# EAGLE design Antenna (EAGLE 7.6.0)

## Sheet 1 of 2

## Sheet 2 of 2
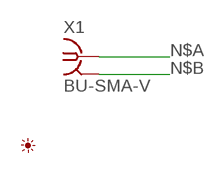
[diagram p0: schematic, sheet 2]

### Parts
PICTO1  PICTO_1  [PICTO_1]
X1  BU-SMA-V  [BU-SMA-V]

### Nets
N$A: X1.1
N$B: X1.2 X1.3 X1.4 X1.5

## Library data of the parts
PICTO1 = My_Picto:PICTO_1: Zdenek Brichacek; OK3ZB; http://blog.brichacek.net
X1 = con-coax:BU-SMA-V: FEMALE SMA CONNECTOR Radiall distributor RS 112-3794; OC_FARNELL: unknown; OC_NEWARK: unknown

## Net classes
1 RF: width 2.5 mm, clearance 0.508 mm
2 net: width 0.6 mm, clearance 0.254 mm

## Board
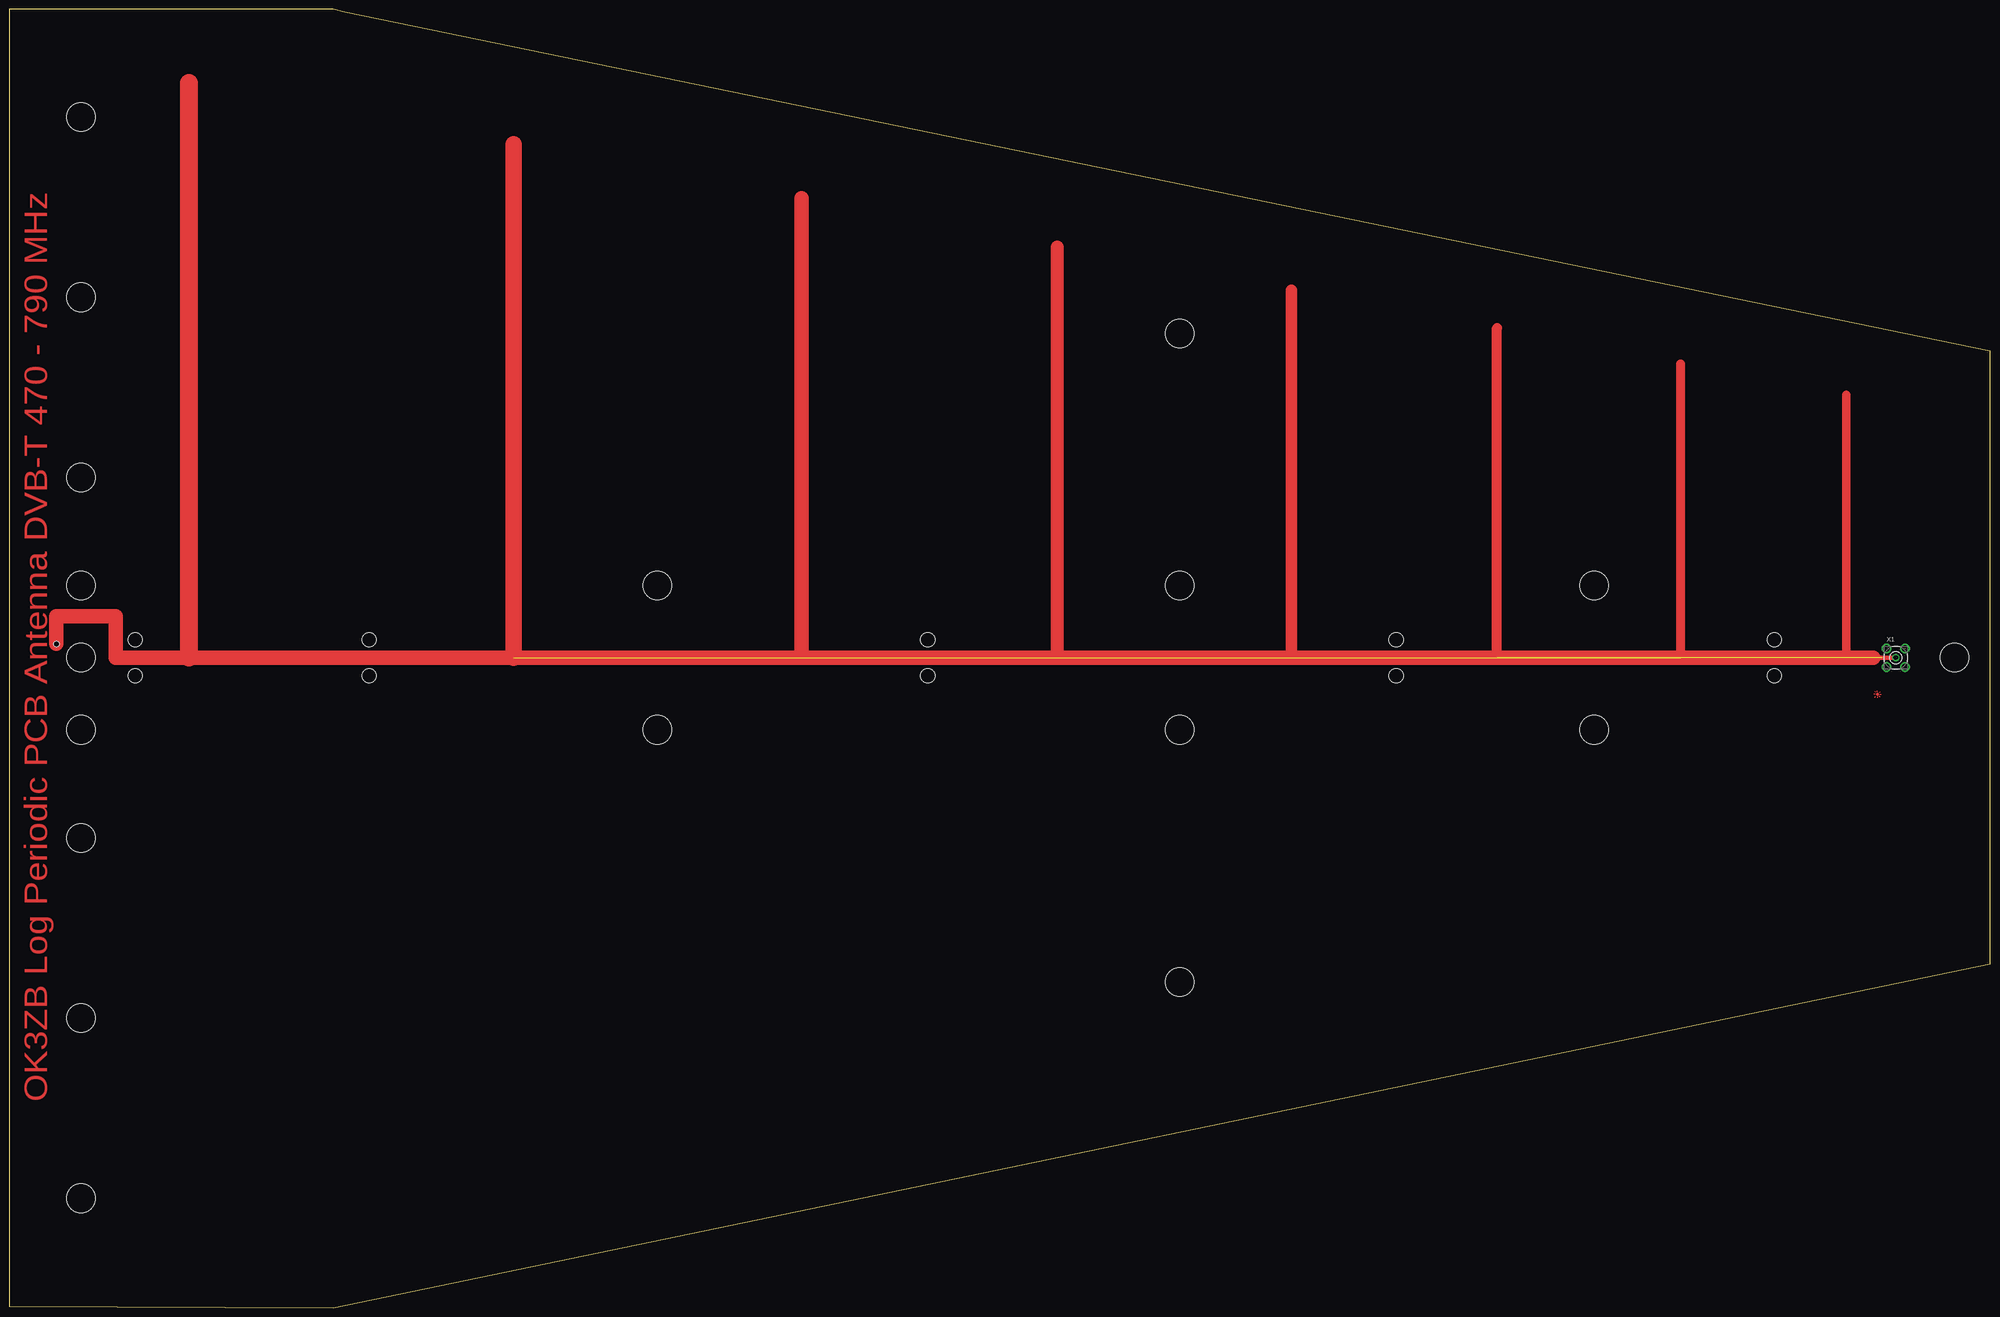
[diagram p1: board, top side]
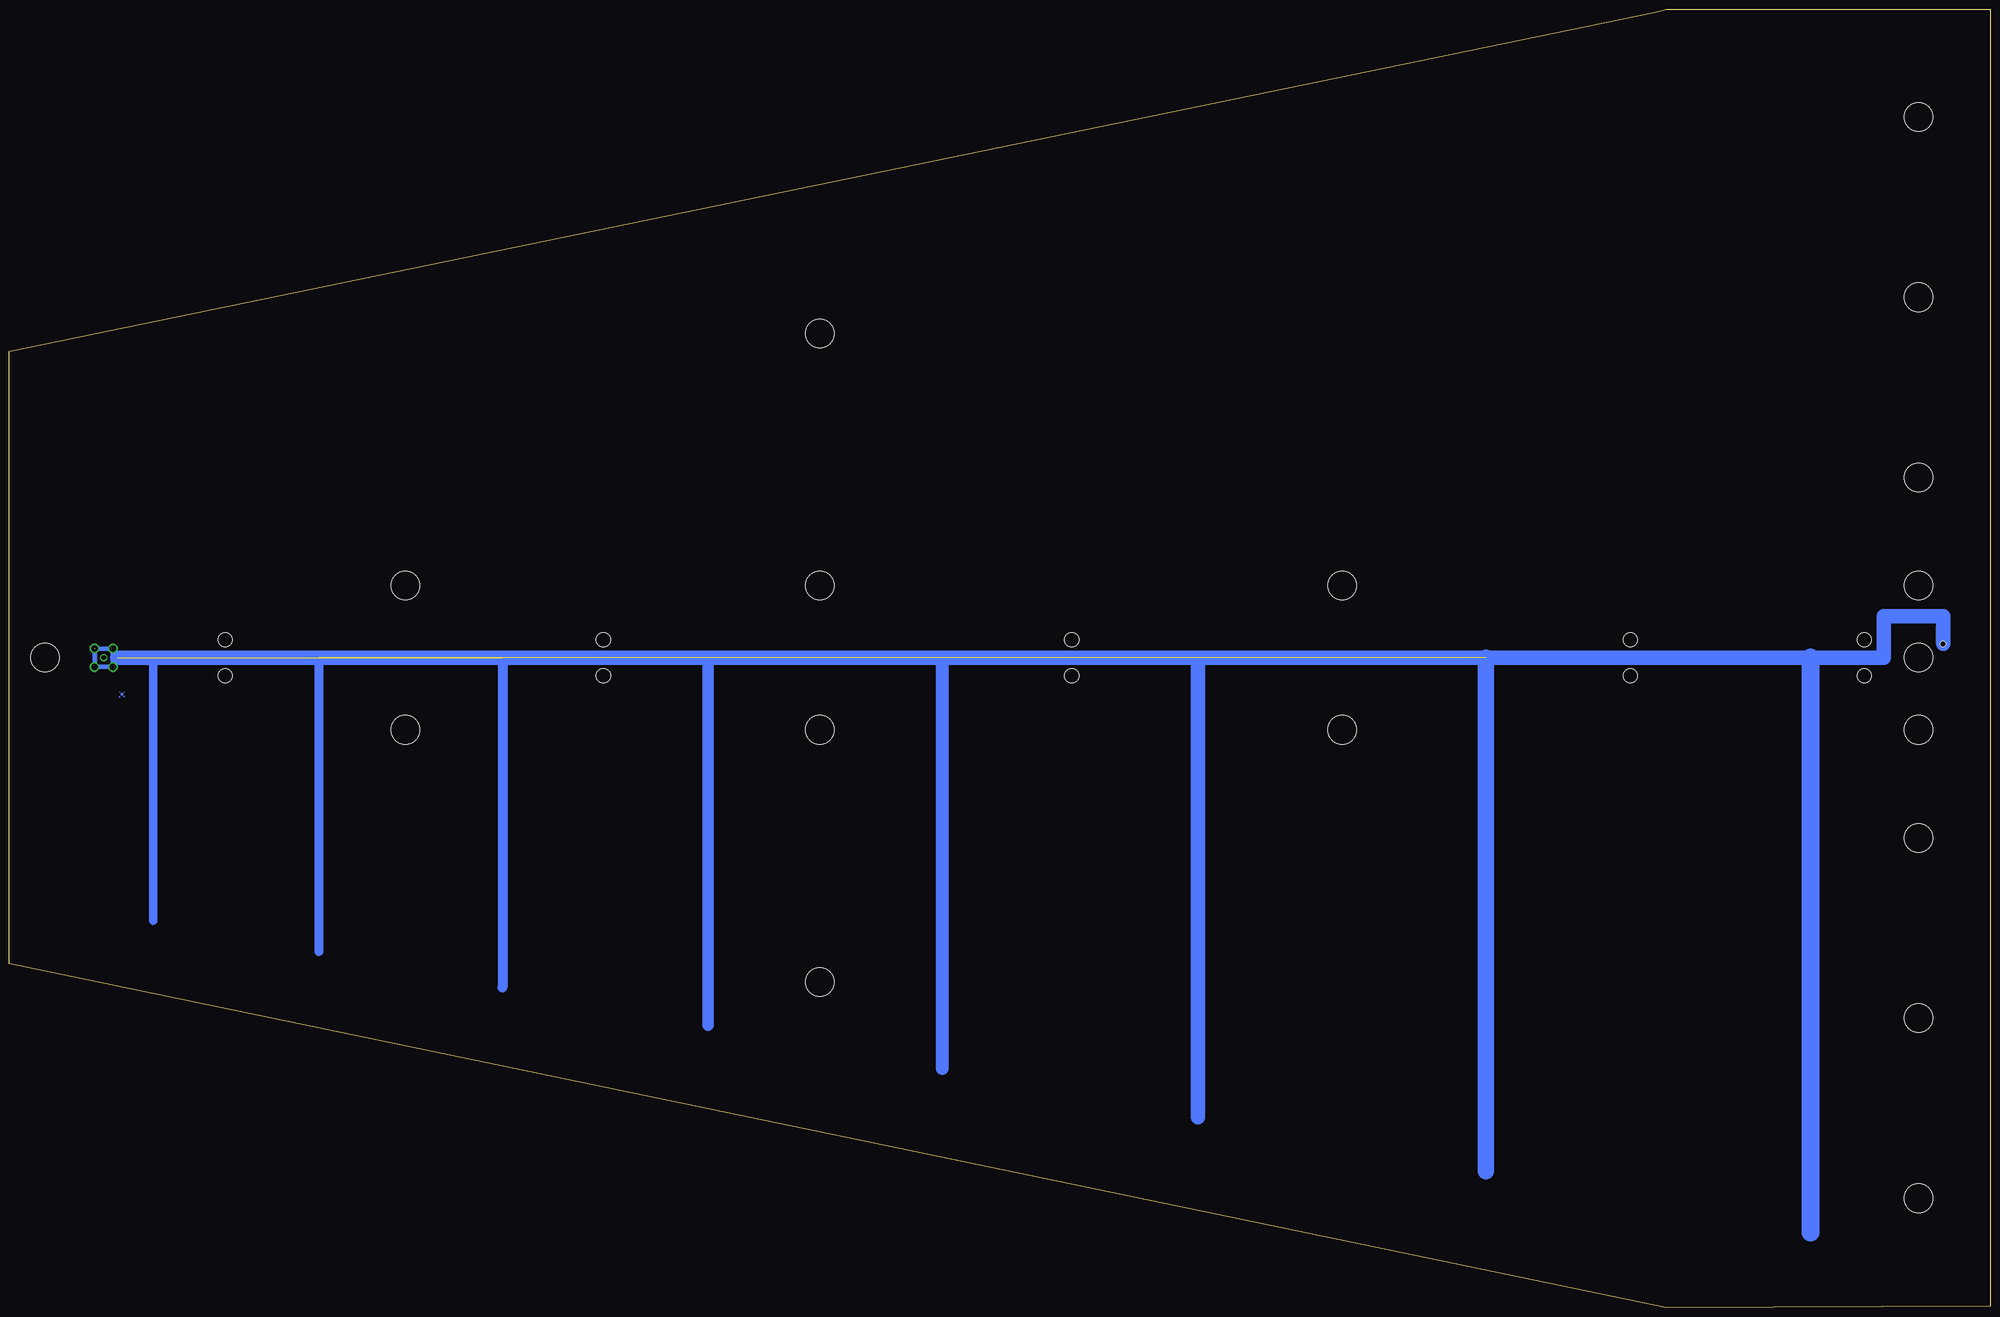
[diagram p2: board, bottom side, seen from below]

Size 550 x 360.34 mm. Coordinates in mm from the lower left corner, seen from the top.
Outline: 0,0.34 90,0 550,95.34 550,265.34 93.18,359.41 90,360.34 0,360.34 0,0.34
Copper layers (1*16): Top 0.035mm / dielectric 1.5mm / Bottom 0.035mm
Design rules "default": minimum track width 10mil, minimum drill 24mil, track to track 8mil, track to pad 8mil, pad to pad 8mil, via to via 8mil, smd to smd 8mil, copper to edge 40mil, drill to drill 8mil, minimum pad ring 10mil, minimum via ring 8mil, stop-mask expansion 4mil, vias tented up to drill 0mil, thermal gap 10mil
Holes 8 mm at 20,180.34 20,230.34 20,280.34 20,330.34 20,130.34 20,80.34 20,30.34 20,200.34 20,160.34 180,200.34 180,160.34 325,200.34 325,160.34 440,200.34 440,160.34 540,180.34 325,270.34 325,90.34
Holes 4 mm at 35,185.34 35,175.34 100,185.34 100,175.34 255,185.34 255,175.34 385,185.34 385,175.34 490,185.34 490,175.34
Holes 1.6 mm at 13.17,184.15

### Footprints (pad centres in the part's own frame; a part is rotated, then mirrored left to right if it is on the bottom)
BU-SMA-V = drill 1.27: 1 0,0 | drill 1.778: 2 -2.55,2.55; 3 2.55,2.55; 4 2.55,-2.55; 5 -2.55,-2.55

### Placement (x,y rotation side)
PICTO1  518.63,170.18 0 top
X1  523.71,180.34 0 top

### Tracks (layer width: path | path; a pad name or v marks a point on that pad's centre or on a via)
N$A  (7 unrouted)
  Top 1.27: X1.1 517.46,180.34
  Top 2.35: 510,180.34 510,253.34
  Top 2.5: 464,180.34 464,261.84
  Top 2.82: 413,180.34 413,271.84
  Top 3.14: 356,180.34 356,282.34
  Top 3.61: 291,180.34 291,294.34
  Top 4: 517.46,180.34 50,180.34 29.68,180.34 29.68,191.77 13.17,191.77 13.17,184.24
  Top 4.08: 220,180.34 220,307.84
  Top 4.555: 140,180.34 140,322.84
  Top 5: 50,180.34 50,339.84
N$B  (8 unrouted)
  Bottom 1.27: X1.2 521.16,180.34 | 521.16,180.34 520,180.34 | 521.16,180.34 X1.5 X1.4 X1.3 X1.2
  Bottom 2.35: 510,180.34 510,107.34
  Bottom 2.5: 464,180.34 464,98.84
  Bottom 2.82: 413,180.34 413,88.84
  Bottom 3.14: 356,180.34 356,78.34
  Bottom 3.61: 291,180.34 291,66.34
  Bottom 4: 520,180.34 50,180.34 29.68,180.34 29.68,191.77 13.17,191.77 13.17,184.15
  Bottom 4.08: 220,180.34 220,52.84
  Bottom 4.555: 140,180.34 140,37.84
  Bottom 5: 50,180.34 50,20.84

### Text on the board
Top: OK3ZB Log Periodic PCB Antenna DVB-T 470 - 790 MHz